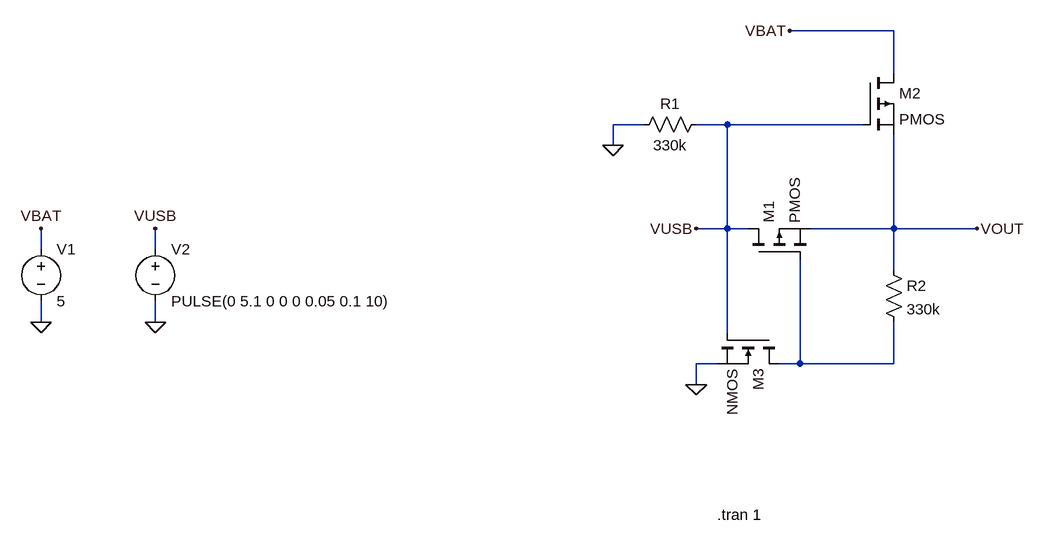
[diagram p0: schematic Draft1.asc]
Draft1.asc, the LTspice schematic file:
Version 4
SHEET 1 976 680
WIRE 768 -160 608 -160
WIRE 768 -96 768 -160
WIRE 384 -16 336 -16
WIRE 512 -16 464 -16
WIRE 720 -16 512 -16
WIRE 336 16 336 -16
WIRE 512 144 512 -16
WIRE 512 144 464 144
WIRE 544 144 512 144
WIRE 768 144 768 0
WIRE 768 144 640 144
WIRE 896 144 768 144
WIRE -544 176 -544 144
WIRE -368 176 -368 144
WIRE 768 208 768 144
WIRE -544 288 -544 256
WIRE -368 288 -368 256
WIRE 512 304 512 144
WIRE 496 352 464 352
WIRE 624 352 624 192
WIRE 624 352 592 352
WIRE 768 352 768 288
WIRE 768 352 624 352
WIRE 464 384 464 352
FLAG -368 288 0
FLAG -544 288 0
FLAG -544 144 VBAT
FLAG -368 144 VUSB
FLAG 608 -160 VBAT
FLAG 896 144 VOUT
FLAG 464 384 0
FLAG 336 16 0
FLAG 464 144 VUSB
SYMBOL voltage -544 160 R0
WINDOW 123 0 0 Left 0
WINDOW 39 0 0 Left 0
SYMATTR InstName V1
SYMATTR Value 5
SYMBOL voltage -368 160 R0
WINDOW 123 0 0 Left 0
WINDOW 39 0 0 Left 0
SYMATTR InstName V2
SYMATTR Value PULSE(0 5.1 0 0 0 0.05 0.1 10)
SYMBOL res 752 192 R0
SYMATTR InstName R2
SYMATTR Value 330k
SYMBOL pmos 720 -96 R0
SYMATTR InstName M2
SYMBOL pmos 544 192 R270
SYMATTR InstName M1
SYMBOL nmos 592 304 R90
SYMATTR InstName M3
SYMBOL res 480 -32 R90
WINDOW 0 0 56 VBottom 2
WINDOW 3 32 56 VTop 2
SYMATTR InstName R1
SYMATTR Value 330k
TEXT 496 584 Left 2 !.tran 1

The netlist it stands for:
* Draft1.asc
V1 VBAT 0 5
V2 VUSB 0 PULSE(0 5.1 0 0 0 0.05 0.1 10)
R2 VOUT N001 330k
M2 VBAT VUSB VOUT VOUT PMOS
M1 VUSB N001 VOUT VOUT PMOS
M3 N001 VUSB 0 0 NMOS
R1 VUSB 0 330k
.model NMOS NMOS
.model PMOS PMOS
.lib standard.mos
.tran 1
.backanno
.end